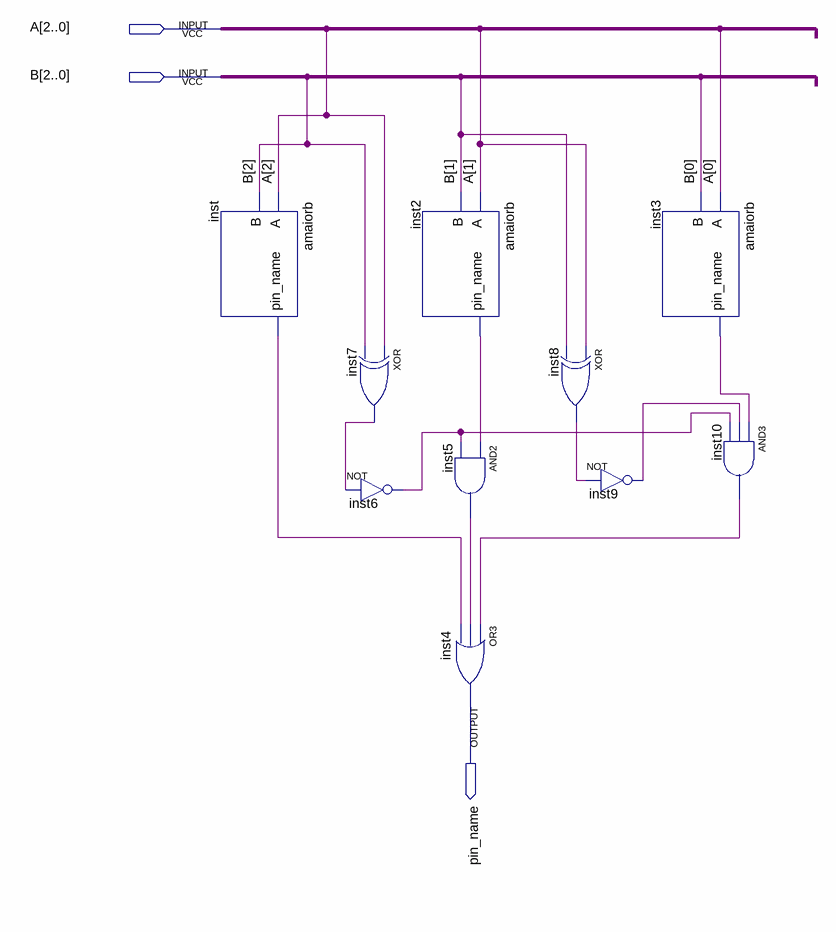
[diagram p0: schematic sheet]
// Quartus schematic amaiorb3bits.bdf as structural Verilog: 10 symbols, 3 pins
module amaiorb3bits (
  input  [2:0] A,
  input  [2:0] B,
  output pin_name
);

  wire inst2_pin_name, inst3_pin_name, inst5_out, inst6_out, inst7_out, inst8_out, inst9_out, inst10_out,
       inst_pin_name;

  amaiorb inst (.A(A[2]), .B(B[2]), .pin_name(inst_pin_name));
  xor inst7 (inst7_out, A[2], B[2]);
  not inst6 (inst6_out, inst7_out);
  amaiorb inst2 (.A(A[1]), .B(B[1]), .pin_name(inst2_pin_name));
  and inst5 (inst5_out, inst2_pin_name, inst6_out);
  or inst4 (pin_name, inst10_out, inst5_out, inst_pin_name);
  xor inst8 (inst8_out, A[1], B[1]);
  not inst9 (inst9_out, inst8_out);
  amaiorb inst3 (.A(A[0]), .B(B[0]), .pin_name(inst3_pin_name));
  and inst10 (inst10_out, inst3_pin_name, inst9_out, inst6_out);
endmodule
